# EAGLE design artemis (EAGLE 5.04)
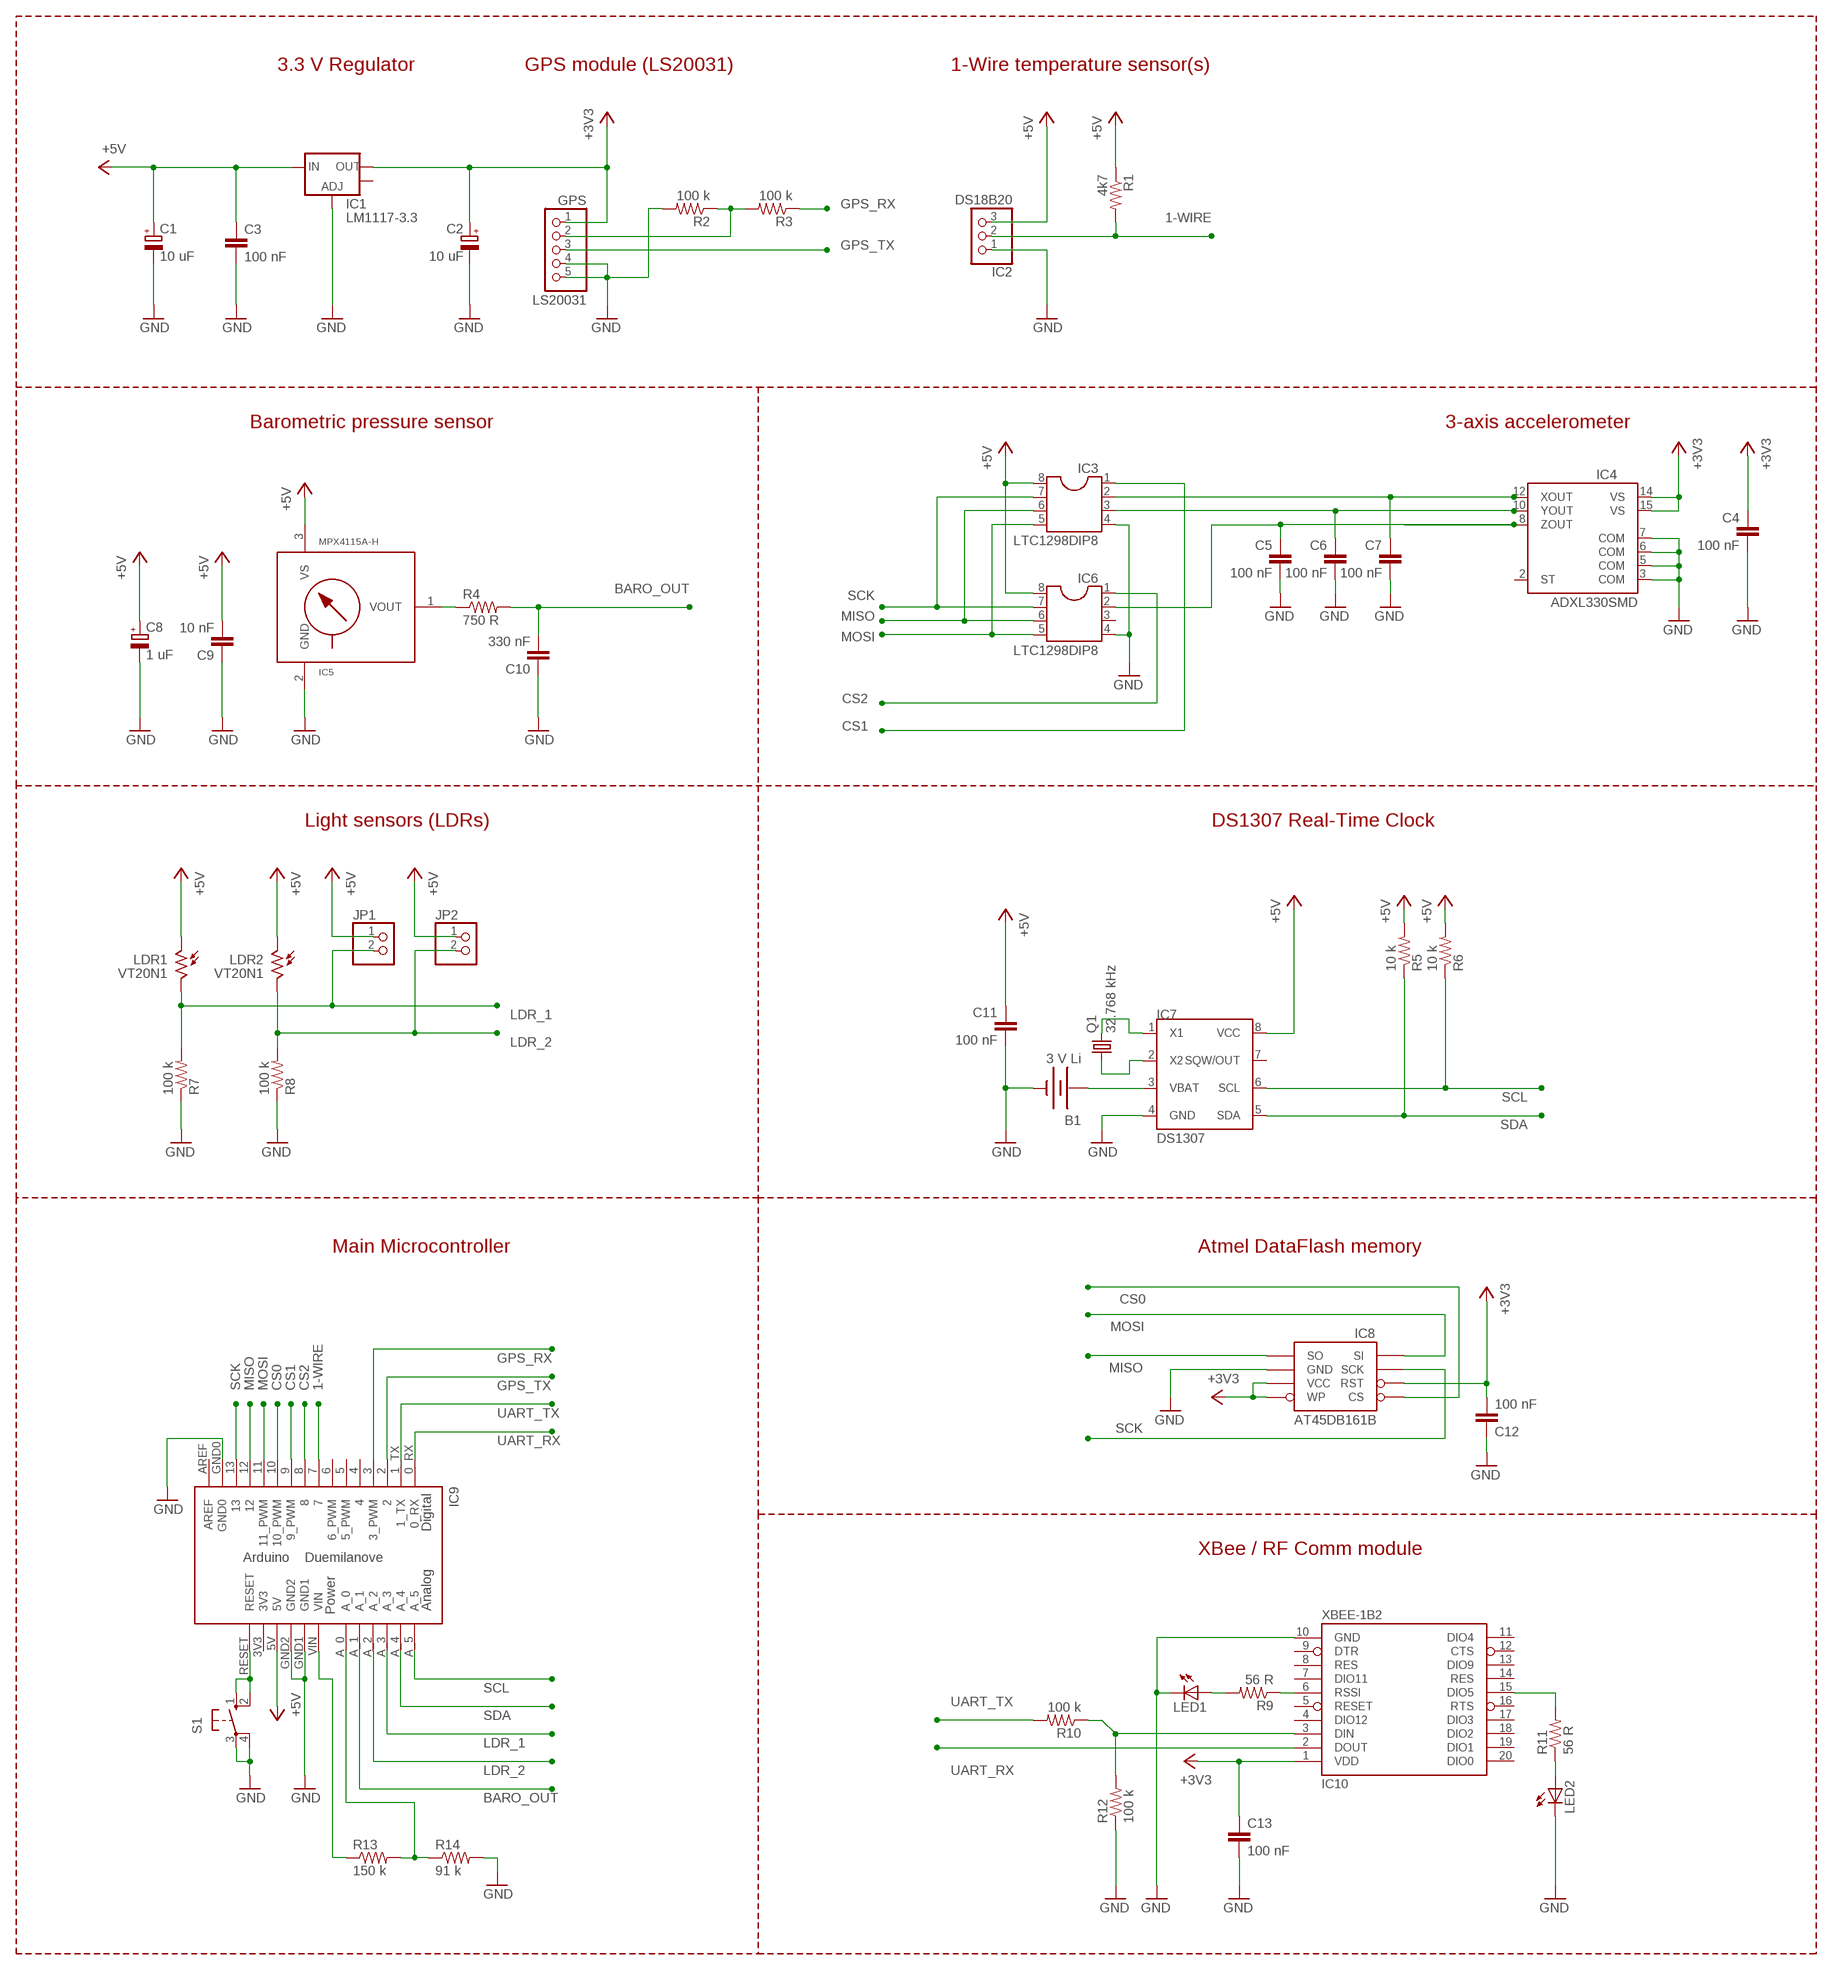
[diagram p0: schematic, sheet 1]

## Parts
B1  3 V Li  BATTERY12MM  [BATTCON_12MM]
C1  10 uF  CPOL-EUE5-5  [E5-5]
C2  10 uF  CPOL-EUE5-5  [E5-5]
C3  100 nF  CAP0805  [0805]
C4  100 nF  CAP0805  [0805]
C5  100 nF  CAP0805  [0805]
C6  100 nF  CAP0805  [0805]
C7  100 nF  CAP0805  [0805]
C8  1 uF  CPOL-EUE5-5  [E5-5]
C9  10 nF  CAP0805  [0805]
C10  330 nF  CAP0805  [0805]
C11  100 nF  CAP0805  [0805]
C12  100 nF  CAP0805  [0805]
C13  100 nF  CAP0805  [0805]
GPS  LS20031  PINHD-1X5  [1X05]
IC1  LM1117-3.3  V_REG_LM1117SOT223  [SOT223]
IC2  DS18B20  PINHD-1X3  [1X03]
IC3  LTC1298DIP8  [LTC1298]
IC4  ADXL330SMD  [LFCSP-16]
IC5  MPX4115A-H  [867-H]
IC6  LTC1298DIP8  [LTC1298]
IC7  DS1307  [SOIC-8]
IC8  AT45DB161B  AT45DB041B  [SO08]
IC9  ARDUINO-USBLONG_PADS_TEXT  [SHIELD]
IC10  XBEE-1B2  [XBEE-SILK]
JP1  PINHD-1X2  [1X02]
JP2  PINHD-1X2  [1X02]
LDR1  VT20N1  [TO46-VT200]
LDR2  VT20N1  [TO46-VT200]
LED1  LED3MM  [LED3MM]
LED2  LED3MM  [LED3MM]
Q1  32.768 kHz  CRYSTALTC38H  [TC38H]
R1  4k7  RESISTOR  [0805]
R2  100 k  RESISTOR  [0805]
R3  100 k  RESISTOR  [0805]
R4  750 R  RESISTOR  [0805]
R5  10 k  RESISTOR  [0805]
R6  10 k  RESISTOR  [0805]
R7  100 k  RESISTOR  [0805]
R8  100 k  RESISTOR  [0805]
R9  56 R  RESISTOR  [0805]
R10  100 k  RESISTOR  [0805]
R11  56 R  RESISTOR  [0805]
R12  100 k  RESISTOR  [0805]
R13  150 k  RESISTOR  [0805]
R14  91 k  RESISTOR  [0805]
S1  10-XX  [B3F-10XX]

## Nets
1-WIRE: IC2.2 IC9.7 R1.2
+3V3: C2.+ C4.1 C12.2 C13.1 GPS.1 IC1.2(OUT) IC4.14(VS) IC4.15(VS) IC8.3(RST) IC8.5(WP) IC8.6(VCC) IC10.1(VDD)
+5V: C1.+ C3.1 C8.+ C9.2 C11.1 IC1.3(IN) IC2.3 IC3.8(VCC) IC5.3(VS) IC6.8(VCC) IC7.8(VCC) IC9.5V JP1.1 JP2.1 LDR1.1 LDR2.1 R1.1 R5.2 R6.2
BARO_OUT: C10.2 IC9.A_1 R4.2
CS0: IC8.4(CS) IC9.10(10_PWM)
CS1: IC3.1(CS/SHDN) IC9.9(9_PWM)
CS2: IC6.1(CS/SHDN) IC9.8
GND: B1.GND(-) C1.- C2.- C3.2 C4.2 C5.2 C6.2 C7.2 C8.- C9.1 C10.1 C11.2 C12.1 C13.2 GPS.4 GPS.5 IC1.1(ADJ) IC2.1 IC3.4(GND) IC4.3(COM) IC4.5(COM) IC4.6(COM) IC4.7(COM) IC5.2(GND) IC6.4(GND) IC7.4(GND) IC8.7(GND) IC9.GND0 IC9.GND1 IC9.GND2 IC10.10(GND) LED1.K(C) LED2.K(C) R2.2 R7.1 R8.1 R12.1 R14.2 S1.3(P) S1.4(P1)
GPS_RX: IC9.3(3_PWM) R3.1
GPS_TX: GPS.3 IC9.2
LDR_1: IC9.A_3 JP1.2 LDR1.2 R7.2
LDR_2: IC9.A_2 JP2.2 LDR2.2 R8.2
MISO: IC3.6(D_OUT) IC6.6(D_OUT) IC8.8(SO) IC9.12
MOSI: IC3.5(D_IN) IC6.5(D_IN) IC8.1(SI) IC9.11(11_PWM)
N$2: B1.PWR@1(+) IC7.3(VBAT)
N$3: IC7.2(X2) Q1.1
N$6: IC9.RESET S1.1(S) S1.2(S1)
N$8: C7.1 IC3.2(CH0) IC4.12(XOUT)
N$11: GPS.2 R2.1 R3.2
N$12: IC5.1(VOUT) R4.1
N$14: C5.1 IC4.8(ZOUT) IC6.2(CH0)
N$16: C6.1 IC3.3(CH1) IC4.10(YOUT)
N$20: IC7.1(X1) Q1.2
N$21: IC9.A_0 R13.2 R14.1
N$22: IC9.VIN R13.1
N$23: IC10.3(DIN) R10.1 R12.2
N$31: IC10.6(RSSI) R9.1
N$32: LED1.A R9.2
N$33: IC10.15(DIO5) R11.2
N$34: LED2.A R11.1
SCK: IC3.7(CLK) IC6.7(CLK) IC8.2(SCK) IC9.13
SCL: IC7.6(SCL) IC9.A_5 R6.1
SDA: IC7.5(SDA) IC9.A_4 R5.1
UART_RX: IC9.0_RX IC10.2(DOUT)
UART_TX: IC9.1_TX R10.2
Unconnected: IC1.4(OUT) IC4.2(ST) IC5.4(NC) IC5.5(NC) IC5.6(NC) IC6.3(CH1) IC7.7(SQW/OUT) IC9.4 IC9.5(5_PWM) IC9.6(6_PWM) IC9.AREF IC10.4(DIO12) IC10.5(RESET) IC10.7(DIO11) IC10.8(RES) IC10.9(DTR) IC10.11(DIO4) IC10.12(CTS) IC10.13(DIO9) IC10.14(RES) IC10.16(RTS) IC10.17(DIO3) IC10.18(DIO2) IC10.19(DIO1) IC10.20(DIO0)

## Notes on the sheet
- 3.3 V Regulator | GPS module (LS20031) | 1-Wire temperature sensor(s)
- Barometric pressure sensor | 3-axis accelerometer
- Light sensors (LDRs) | DS1307 Real-Time Clock
- Main Microcontroller | Atmel DataFlash memory
- XBee / RF Comm module

## Power pins joined to a net without a drawn wire
3V3: IC9.3V3

## Library data of the parts
B1 = SparkFun:BATTERY: Battery Holders Various common sizes : AA, AAA, 20mm coin cell and 12mm coin cell.
C1 C2 C8 = rcl:CPOL-EU: POLARIZED CAPACITOR, European symbol
C3-C7 C9-C13 = SparkFun:CAP: Capacitor Standard 0603 ceramic capacitor, and 0.1" leaded capacitor.
GPS = pinhead:PINHD-1X5: PIN HEADER
IC1 = SparkFun:V_REG_LM1117: Voltage Regulator LM1117 Standard adjustable voltage regulator but in SMD form. Spark Fun Electronics SKU : COM-00595
IC2 = pinhead:PINHD-1X3: PIN HEADER
IC3 IC6 = Goth:LTC1298: LTC1298 12Bit ADC
IC4 = SparkFun:ADXL330: Triple Axis Accelerometer Analog Devices ADXL330 +/-3g 2.4V-5.25V Analog output. Spark Fun Electronics SKU : COM-00730. Center pad paste layer has been reduced to avoid shorting.
IC5 = mpx-freescale:MPX4115A: Integrated Silicon Pressure Sensor for Manifold Absolute Pressure, Altimeter or Barometer Applications On-Chip Signal Conditioned, Temperature Compensated and Calibrated INTEGRATED PRESSURE SENSOR 15 to 115 kPa (2.2 to 16.7 psi) 0.2 to 4.8 Volts Output
IC7 = dallas-1:DS1307: I2C Serial RTC w/56 bytes battery backed RAM
IC8 = SparkFun:AT45DB041B
IC9 = Arduino-Various:ARDUINO-USB: The Ardiuno Duemilanove Pinouts layoutet as a Bare Shield. v0.5 Also for Arduino Diecimila. This is designed as a Part and has no Outline in the Dimension Layer. The Outline, when present, is drawed at the tPlace / bPlace Layer. Library by Stephanie Lange, http://www.k-ita.de/~sl/
IC10 = SparkFun:XBEE-1
JP1 JP2 = pinhead:PINHD-1X2: PIN HEADER
LDR1 LDR2 = photo-elements:VT2*: Photoconductive Cell VT200 Series Source: http://optoelectronics.perkinelmer.com/content/Datasheets/DTS_vt200seriesdatasheet.pdf
LED1 LED2 = led:LED: LED OSRAM: - CHIPLED LG R971, LG N971, LY N971, LG Q971, LY Q971, LO R971, LY R971 LH N974, LH R974 LS Q976, LO Q976, LY Q976 LO Q996 - Hyper CHIPLED LW Q18S LB Q993, LB Q99A, LB R99A - SideLED LS A670, LO A670, LY A670, LG A670, LP A670 LB A673, LV A673, LT A673, LW A673 LH A674 LY A675 LS A676, LA A676, LO A676, LY A676, LW A676 LS A679, LY A679, LG A679 - Hyper Micro SIDELED® LS Y876, LA Y876, LO Y876, LY Y876 LT Y87S - SmartLED LW L88C, LW L88S LB L89C, LB L89S, LG L890 LS L89K, LO L89K, LY L89K LS L896, LA L896, LO L896, LY L896 - TOPLED LS T670, LO T670, LY T670, LG T670, LP T670 LSG T670, LSP T670, LSY T670, LOP T670, LYG T670 LG T671, LOG T671, LSG T671 LB T673, LV T673, LT T673, LW T673 LH T674 LS T676, LA T676, LO T676, LY T676, LB T676, LH T676, LSB T676, LW T676 LB T67C, LV T67C, LT T67C, LS T67K, LO T67K, LY T67K, LW E67C LS E67B, LA E67B, LO E67B, LY E67B, LB E67C, LV E67C, LT E67C LW T67C LS T679, LY T679, LG T679 LS T770, LO T770, LY T770, LG T770, LP T770 LB T773, LV T773, LT T773, LW T773 LH T774 LS E675, LA E675, LY E675, LS T675 LS T776, LA T776, LO T776, LY T776, LB T776 LHGB T686 LT T68C, LB T68C - Hyper Mini TOPLED® LB M676 - Mini TOPLED Santana® LG M470 LS M47K, LO M47K, LY M47K Source: http://www.osram.convergy.de LUXEON: - LUMILED® LXK2-PW12-R00, LXK2-PW12-S00, LXK2-PW14-U00, LXK2-PW14-V00 LXK2-PM12-R00, LXK2-PM12-S00, LXK2-PM14-U00 LXK2-PE12-Q00, LXK2-PE12-R00, LXK2-PE12-S00, LXK2-PE14-T00, LXK2-PE14-U00 LXK2-PB12-K00, LXK2-PB12-L00, LXK2-PB12-M00, LXK2-PB14-N00, LXK2-PB14-P00, LXK2-PB14-Q00 LXK2-PR12-L00, LXK2-PR12-M00, LXK2-PR14-Q00, LXK2-PR14-R00 LXK2-PD12-Q00, LXK2-PD12-R00, LXK2-PD12-S00 LXK2-PH12-R00, LXK2-PH12-S00 LXK2-PL12-P00, LXK2-PL12-Q00, LXK2-PL12-R00 Source: www.luxeon.com KINGBRIGHT: KA-3528ASYC Source: www.kingbright.com
Q1 = SparkFun:CRYSTAL: Crystals Various standard crystals. Proven footprints. Spark Fun Electronics SKU : COM-00534
R1-R14 = SparkFun:RESISTOR: Resistor Basic schematic elements and footprints for 0603, 1206, and PTH 1/10th watt (small) resistors.
S1 = switch-omron:10-XX: OMRON SWITCH

## Board
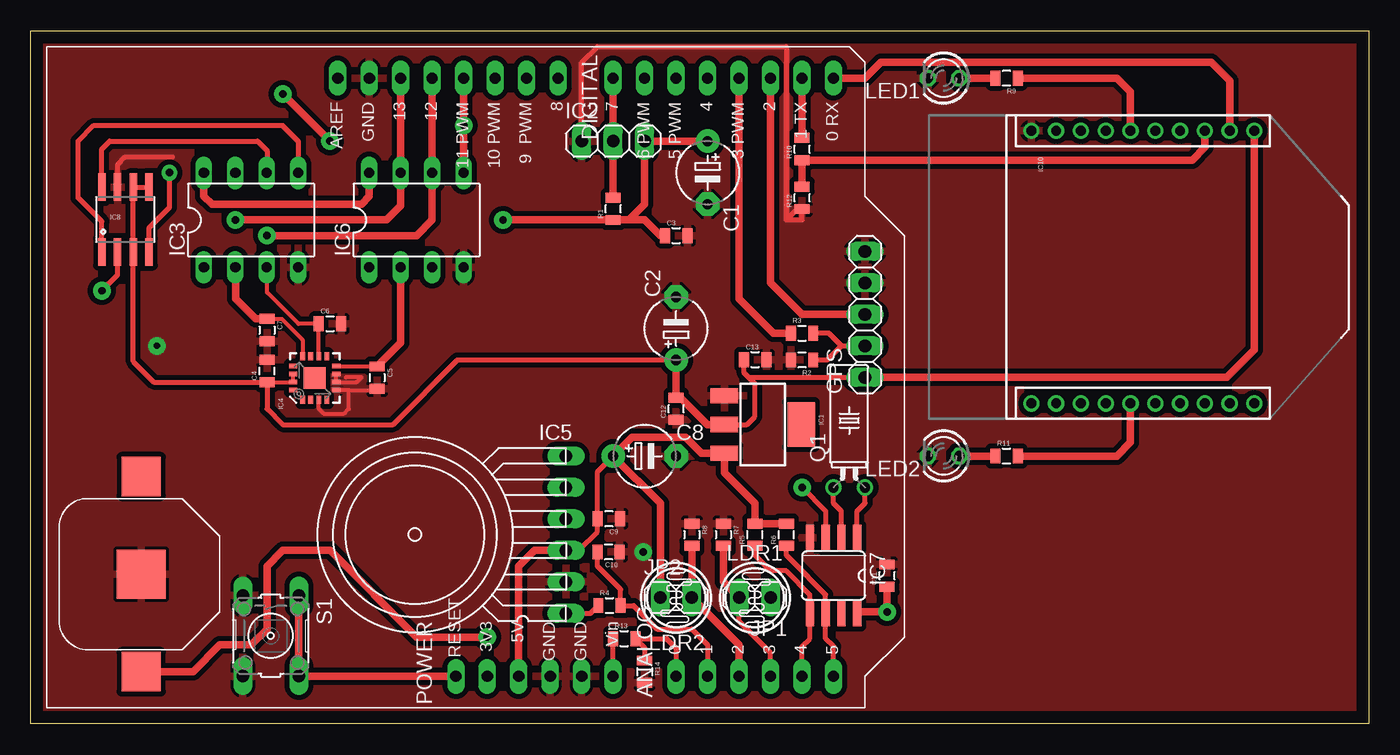
[diagram p1: board, top side]
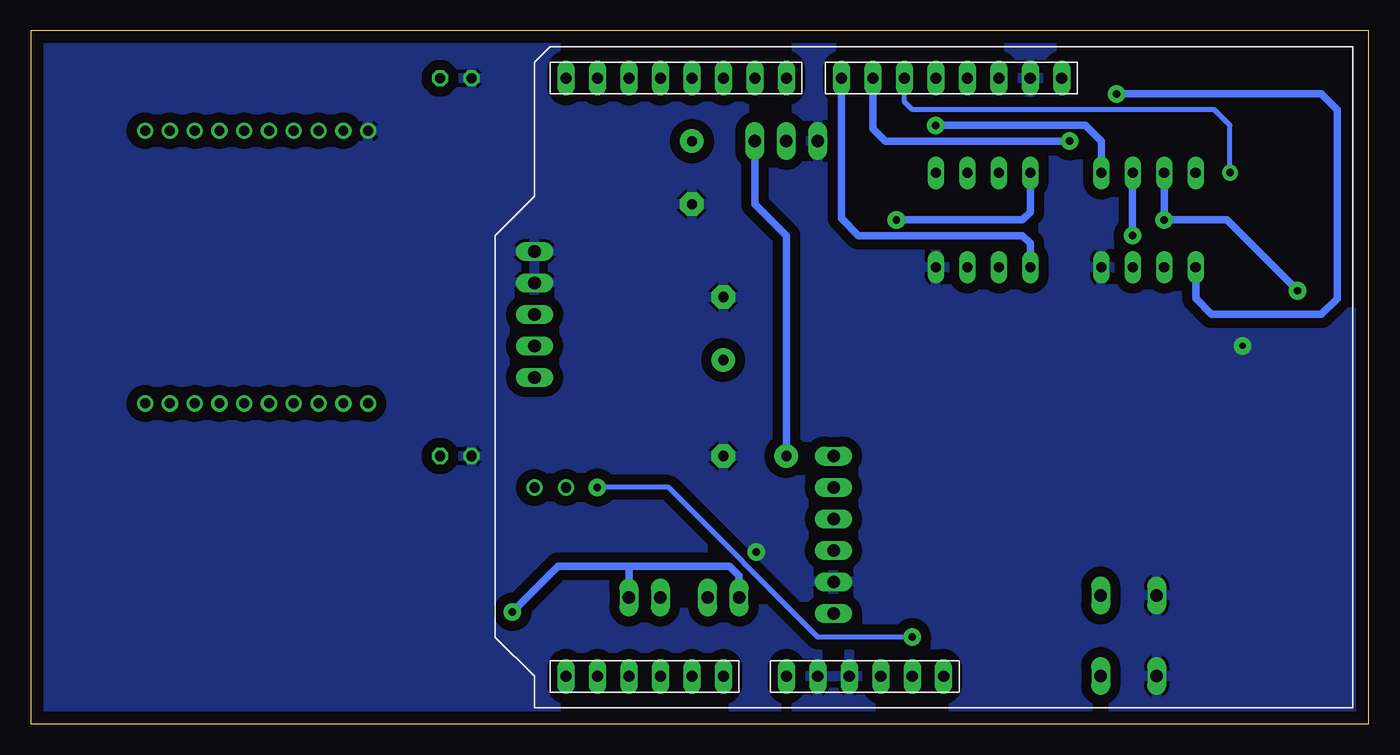
[diagram p2: board, bottom side, seen from below]

Size 107.95 x 55.88 mm. Coordinates in mm from the lower left corner, seen from the top.
Outline: 0,55.88 107.95,55.88 107.95,0 0,0 0,55.88
Copper layers (1*16): Top 0.035mm / dielectric 1.5mm / Bottom 0.035mm
Design rules "default": minimum track width 10mil, minimum drill 24mil, track to track 8mil, track to pad 8mil, pad to pad 8mil, via to via 8mil, smd to smd 8mil, copper to edge 40mil, drill to drill 8mil, minimum pad ring 10mil, minimum via ring 8mil, stop-mask expansion 4mil, vias tented up to drill 0mil, thermal gap 10mil

### Footprints (pad centres in the part's own frame; a part is rotated, then mirrored left to right if it is on the bottom)
BATTCON_12MM = smd 3.962 x 3.962: GND 0,0 | smd 3.175 x 3.175: PWR@1 -7.874,0; PWR@2 7.874,0
E5-5 = drill 0.813 pad 1.905 round: + -2.54,0 | drill 0.813 pad 1.905 octagon: - 2.54,0
0805 = smd 0.8 x 1.2: 1 -0.9,0; 2 0.9,0
1X05 = drill 1.016 long: 1 -5.08,0; 2 -2.54,0; 3 0,0; 4 2.54,0; 5 5.08,0
SOT223 = smd 1.219 x 2.235: 1 -2.311,-3.099; 2 0,-3.099; 3 2.311,-3.099 | smd 3.6 x 2.2: 4 0,3.099
1X03 = drill 1.016 long: 1 -2.54,0; 2 0,0; 3 2.54,0
LTC1298 = drill 0.813 long: 1 -3.81,-3.81; 2 -1.27,-3.81; 3 1.27,-3.81; 4 3.81,-3.81; 5 3.81,3.81; 6 1.27,3.81; 7 -1.27,3.81; 8 -3.81,3.81
LFCSP-16 = smd 1.75 x 1.75: 0 0,0 | smd 0.65 x 0.37: 1 -1.75,0.975; 2 -1.75,0.325; 3 -1.75,-0.325; 4 -1.75,-0.975; 9 1.75,-0.975; 10 1.75,-0.325; 11 1.75,0.325; 12 1.75,0.975 | smd 0.37 x 0.65: 5 -0.975,-1.75; 6 -0.325,-1.75; 7 0.325,-1.75; 8 0.975,-1.75; 13 0.975,1.75; 14 0.325,1.75; 15 -0.325,1.75; 16 -0.975,1.75
867-H = drill 1.016 long: 1 -6.35,-12.192; 2 -3.81,-12.192; 3 -1.27,-12.192; 4 1.27,-12.192; 5 3.81,-12.192; 6 6.35,-12.192
SOIC-8 = smd 2.032 x 0.66: 1 -3.073,1.27; 2 -3.073,0; 3 -3.073,-1.27; 4 -3.073,-2.54; 5 3.073,-2.54; 6 3.073,-1.27; 7 3.073,0; 8 3.073,1.27
SO08 = smd 0.61 x 2.21: 1 -1.905,-2.616; 2 -0.635,-2.616; 3 0.635,-2.616; 4 1.905,-2.616; 5 1.905,2.616; 6 0.635,2.616; 7 -0.635,2.616; 8 -1.905,2.616
SHIELD = drill 0.9 pad 1.27 long: 0_RX -25.4,27.94; 1_TX -25.4,25.4; 2 -25.4,22.86; 3 -25.4,20.32; 3V3 22.86,0; 4 -25.4,17.78; 5 -25.4,15.24; 5V 22.86,2.54; 6 -25.4,12.7; 7 -25.4,10.16; 8 -25.4,5.715; 9 -25.4,3.175; 10 -25.4,0.635; 11 -25.4,-1.905; 12 -25.4,-4.445; 13 -25.4,-6.985; A_0 22.86,15.24; A_1 22.86,17.78; A_2 22.86,20.32; A_3 22.86,22.86; A_4 22.86,25.4; A_5 22.86,27.94; AREF -25.4,-12.065; GND0 -25.4,-9.525; GND1 22.86,7.62; GND2 22.86,5.08; RESET 22.86,-2.54; VIN 22.86,10.16
XBEE-SILK = drill 0.8 round: 1 -11,20; 2 -11,18; 3 -11,16; 4 -11,14; 5 -11,12; 6 -11,10; 7 -11,8; 8 -11,6; 9 -11,4; 10 -11,2; 11 11,2; 12 11,4; 13 11,6; 14 11,8; 15 11,10; 16 11,12; 17 11,14; 18 11,16; 19 11,18; 20 11,20
1X02 = drill 1.016 long: 1 -1.27,0; 2 1.27,0
TO46-VT200 = drill 0.8 pad 1.4 round: 1 -1.27,0; 2 1.27,0
LED3MM = drill 0.813 octagon: A -1.27,0; K 1.27,0
TC38H = drill 0.813 round: 1 -1.27,0; 2 1.27,0
B3F-10XX = drill 1.016 long: 1 -3.251,2.261; 2 3.251,2.261; 3 -3.251,-2.261; 4 3.251,-2.261

### Placement (x,y rotation side)
B1  8.89,12.06 90 top
C1  54.61,44.45 270 top
C2  52.07,31.88 90 top
C3  52.07,39.37 0 top
C4  19.05,28.45 90 top
C5  27.94,27.91 270 top
C6  24.13,32.26 0 top
C7  19.05,31.75 270 top
C8  49.53,21.59 0 top
C9  46.64,16.52 180 top
C10  46.62,13.85 180 top
C11  69.09,11.94 90 top
C12  52.07,25.4 90 top
C13  58.45,29.36 0 top
GPS  67.31,33.02 90 top
IC1  59.05,24.13 270 top
IC2  46.99,46.99 0 top
IC3  17.77,40.63 0 top
IC4  22.9,27.88 90 top
IC5  30.99,15.24 90 top
IC6  31.11,40.63 0 top
IC7  65.41,11.94 270 top
IC8  7.62,40.67 0 top
IC9  36.83,26.67 270 top
IC10  78.74,36.83 270 top
JP1  58.42,10.16 180 top
JP2  52.07,10.16 0 top
LDR1  58.42,10.16 180 top
LDR2  52.07,10.16 0 top
LED1  73.66,52.07 180 top
LED2  73.66,21.59 180 top
Q1  66.04,19.05 0 top
R1  46.99,41.53 90 top
R2  62.23,29.34 180 top
R3  62.23,31.5 0 top
R4  46.69,9.53 0 top
R5  58.42,15.24 90 top
R6  60.96,15.24 90 top
R7  55.88,15.24 270 top
R8  53.34,15.24 270 top
R9  78.74,52.07 180 top
R10  62.23,46.35 90 top
R11  78.74,21.59 0 top
R12  62.23,42.42 90 top
R13  47.88,6.86 0 top
R14  49.53,4.19 270 top
S1  19.35,7.09 270 top

### Tracks (layer width: path | path; a pad name or v marks a point on that pad's centre or on a via)
1-WIRE
  Top 0.61: R1.2 IC2.2 IC9.7
+3V3
  Top 0.305: 19.07,27.55 C4.1 IC4.15 IC4.14
  Top 0.406: C13.1 57.54,28.31 57.91,27.94 | 57.91,27.94 GPS.1 | 57.91,27.94 58.42,27.43 58.42,24.77 57.78,24.13 IC1.2 | C4.1 19.05,25.4 20.32,24.13 29.21,24.13 34.42,29.34 C2.+ | C4.1 9.91,27.55 8.26,29.21 IC8.3 IC8.6 IC8.5
  Top 0.61: C13.1 57.52,29.34 | C2.+ C12.2 52.44,26.3 54.61,24.13 IC1.2 | IC10.1 98.74,30.16 96.52,27.94 GPS.1
+5V  (via drill 0.6, 0.6 pad 1.42)
  Top 0.406: IC5.3 44.2,13.97 45.72,15.49 45.72,16.5 | C9.2 45.74,20.34 C8.+
  Top 0.61: IC3.8 13.96,42.56 14.61,41.91 26.67,41.91 27.3,42.55 IC6.8 | IC5.3 40.64,13.97 39.37,12.7 IC9.5V | 48.26,40.64 49.53,41.91 IC2.3 C1.+ | R1.1 v38.1,40.64 | 48.26,40.64 R1.1 | R1.1 | R6.2 R5.2 58.42,17.78 55.96,20.24 IC1.3 54.13,21.82 52.83,23.11 48.51,23.11 C8.+ 50.8,17.78 JP2.1 | IC7.8 66.83,9.02 v69.09,9.02 C11.1 | 45.72,16.5 C9.2 45.72,16.54 | C3.1 50.8,39.37 49.53,40.64 48.26,40.64
  Bottom 0.61: IC6.8 27.3,41.27 27.94,40.64 v38.1,40.64 | C8.+ 46.99,39.37 49.53,41.91 IC2.3 | JP2.1 50.8,11.94 51.56,12.7 59.69,12.7 | 59.69,12.7 65.41,12.7 v69.09,9.02 | 59.69,12.7 JP1.1
BARO_OUT
  Top 0.406: IC9.A_1 54.61,6.35 53.34,7.62 50.55,7.62 48.64,9.53 R4.2 | R4.2 47.63,9.57 | R4.2 47.58,10.84 45.72,12.7 C10.2
  Top 0.61: R4.2 47.62,9.56
CS0  (via drill 0.6 pad 1.27)
  Top 0.406: v11.18,44.45 11.18,41.66 9.53,40.01 IC8.4
  Bottom 0.406: IC9.10 37.46,50.16 36.83,49.53 12.45,49.53 11.18,48.26 v11.18,44.45
CS1  (via drill 0.6, 0.6 pad 1.42)
  Top 0.61: v20.32,50.8 v24.13,46.99
  Bottom 0.61: IC3.1 13.96,34.3 12.68,33.02 3.81,33.02 2.54,34.29 2.54,49.53 3.81,50.8 v20.32,50.8 | IC9.9 40,48.01 38.99,46.99 v24.13,46.99
CS2
  Bottom 0.61: IC6.1 27.3,38.73 27.94,39.37 41.15,39.37 42.54,40.77 IC9.8
GND  (via drill 0.5 pad 1.42, 0.6 pad 1.42)
  Top 0.305: 25.65,26.9 IC4.5 | 25.65,26.9 27.83,26.9 C5.2 | 25.4,27.94 26.67,27.94 26.28,27.55 IC4.6 IC4.7 | IC4.3 23.22,25.42 23.62,25.02 25.27,25.02 25.65,25.4 25.65,26.9
  Top 0.406: IC8.7 6.99,45.09 7.62,45.72 11.43,45.72 | 60.96,40.64 62.23,40.64 R12.1 61.84,41.52 60.96,40.64 | 60.96,40.64 60.96,53.34 | 60.96,40.64 60.96,54.61 45.72,54.61 44.45,53.34 IC2.1
  other vias: 49.4,13.84 10.16,30.48
  pour Top (isolate 0.406): 0,55.88 107.95,55.88 107.95,0 0,0
  pour Bottom (isolate 0.813): 0,55.88 0,0 107.95,0 107.95,55.88
GPS_RX
  Top 0.61: IC9.3 57.15,34.29 59.94,31.5 R3.1
GPS_TX
  Top 0.61: GPS.3 62.23,33.02 59.69,35.56 IC9.2
LDR_1
  Top 0.406: JP1.2 57.15,8.26 59.69,5.71 IC9.A_3
  Top 0.61: JP1.2 55.88,11.43 R7.2
LDR_2
  Top 0.61: IC9.A_2 57.15,6.35 JP2.2 R8.2
MISO  (via drill 0.6 pad 1.42)
  Top 0.406: IC8.8 5.71,46.35 6.35,46.99 18.29,46.99 19.05,46.23 IC3.6
  Top 0.61: IC9.12 IC6.6 32.38,40.64 31.11,39.37 v19.05,39.37
  Bottom 0.406: IC3.6
  Bottom 0.61: IC3.6 v19.05,39.37
MOSI  (via drill 0.6 pad 1.42)
  Top 0.406: IC8.1 5.71,40.51 3.81,42.42 3.81,46.99 5.08,48.26 20.32,48.26 20.32,48.23 21.58,46.98 IC3.5
  Top 0.61: IC6.5 v34.92,48.26 IC9.11
  Bottom 0.61: v34.92,48.26 22.86,48.26 21.58,46.98 IC3.5
N$1  (via drill 0.6 pad 1.42)
  other vias: 69.09,9.02
N$2  (via drill 0.6 pad 1.42)
  Top 0.406: IC7.3 64.14,17.14 v62.23,19.05
  Top 0.61: v36.83,6.99 31.11,6.99 24.13,13.97 20.32,13.97 19.05,12.7 19.05,7.62 17.78,6.35 15.24,6.35 13.08,4.19 B1.PWR@1
  Bottom 0.406: v62.23,19.05 56.51,19.05 44.45,6.99 v36.83,6.99
N$3
  Top 0.406: IC7.2 65.41,17.14 64.77,17.78 Q1.1
N$6
  Top 0.61: 34.26,3.79 IC9.RESET 34.26,3.83 S1.2 S1.1
N$8
  Top 0.305: C7.1 20.23,32.65 21.92,30.96 IC4.12
  Top 0.61: C7.1 18.15,32.65 16.51,34.29 16.51,36.8 IC3.2
N$11
  Top 0.406: R2.1 64.26,29.34 65.41,30.48 | 65.41,30.48 GPS.2 | R3.2 64.39,31.5 65.41,30.48
N$12
  Top 0.406: IC5.1 45.15,8.89 R4.1
N$14
  Top 0.305: 27.98,28.85 C5.1 27.9,28.85 IC4.8
  Top 0.61: IC6.2 29.84,30.72 C5.1
N$16
  Top 0.305: IC4.10 23.22,32.12 C6.1 21.59,32.26 19.05,34.8 19.05,36.8 IC3.3
N$19  (via drill 0.6 pad 1.42)
  other vias: 24.13,46.99
N$20
  Top 0.406: IC7.1 66.67,17.14 67.31,17.78 Q1.2
N$21
  Top 0.406: IC9.A_0 52.07,6.1 51.31,6.86 R13.2 49.53,6.11 R14.1
N$22
  Top 0.406: R13.1 46.98,3.82 IC9.VIN
N$23
  Top 0.61: R12.2 R10.1 93.72,45.45 94.74,46.48 IC10.3
N$31
  Top 0.61: IC10.6 88.74,50.96 87.63,52.07 R9.1
N$32
  Top 0.61: LED1.A R9.2
N$33
  Top 0.61: IC10.15 88.74,22.7 87.63,21.59 R11.2
N$34
  Top 0.61: LED2.A R11.1
SCK  (via drill 0.6 pad 1.42)
  Top 0.406: IC8.2 6.99,36.2 v5.71,34.92
  Top 0.61: IC9.13 IC6.7 29.84,41.78 28.7,40.64 v16.51,40.64
  Bottom 0.61: IC3.7 16.5,40.65 v16.51,40.64 11.43,40.64 v5.71,34.92
SCL
  Top 0.406: IC9.A_5 64.77,6.22 64.14,6.86 IC7.6 64.14,10.41 61.4,13.14 | R6.1 60.96,13.59 61.4,13.14 | 61.4,13.14 61.85,12.7
SDA
  Top 0.406: IC9.A_4 62.23,6.22 62.87,6.86 IC7.5 62.87,9.65 62.87,10.41 60.96,12.32 59.69,12.32 58.42,13.59 R5.1
UART_RX
  Top 0.61: IC9.0_RX 67.31,52.07 68.58,53.34 95.25,53.34 96.74,51.85 IC10.2
UART_TX
  Top 0.61: R10.2 IC9.1_TX

### Text on the board
_tNames: LED2 | R11 | JP2 | R6 | IC7 | C20 | R7 | IC6 | R5 | C21 | IC4 | IC5 | C8 | C10 | C11 | R10 | C1 | C9 | R9 | C7 | IC3 | C5 | IC11 | Q1 | R12 | C6 | LED4 | R4 | R3 | JP1 | R2 | R1 | LDR2 | S2 | C3 | C2 | PS1 | R16 | LDR1 | IC2 | C4